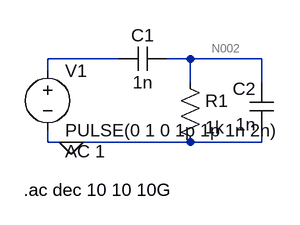
[diagram p0: schematic Draft9.asc]
Draft9.asc, the LTspice schematic file:
Version 4
SHEET 1 880 680
WIRE 128 112 32 112
WIRE 224 112 192 112
WIRE 320 112 224 112
WIRE 32 128 32 112
WIRE 224 144 224 112
WIRE 320 144 320 112
WIRE 32 224 32 208
WIRE 64 224 32 224
WIRE 224 224 64 224
WIRE 320 224 320 208
WIRE 320 224 224 224
FLAG 64 224 0
SYMBOL voltage 32 112 R0
WINDOW 123 24 124 Left 2
WINDOW 39 0 0 Left 0
SYMATTR InstName V1
SYMATTR Value PULSE(0 1 0 1p 1p 1n 2n)
SYMATTR Value2 AC 1
SYMBOL cap 192 96 R90
WINDOW 0 0 32 VBottom 2
WINDOW 3 32 32 VTop 2
SYMATTR InstName C1
SYMATTR Value 1n
SYMBOL cap 336 208 R180
WINDOW 0 24 56 Left 2
WINDOW 3 24 8 Left 2
SYMATTR InstName C2
SYMATTR Value 1n
SYMBOL res 208 128 R0
SYMATTR InstName R1
SYMATTR Value 1k
TEXT 0 288 Left 2 !.ac dec 10 10 10G

The netlist it stands for:
* Draft9.asc
V1 N001 0 PULSE(0 1 0 1p 1p 1n 2n) AC 1
C1 N002 N001 1n
C2 0 N002 1n
R1 N002 0 1k
.ac dec 10 10 10G
.backanno
.end

* Results of the author's LTspice run, read from the files saved beside the schematic
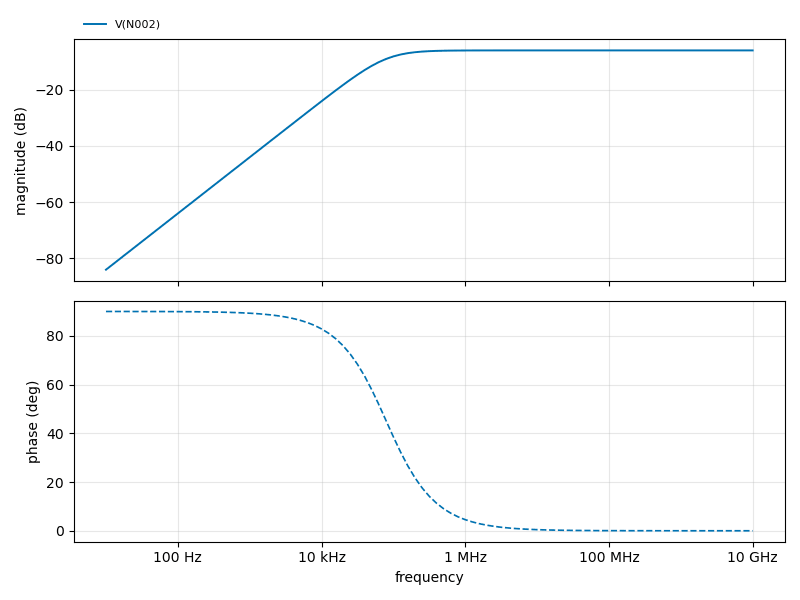
[diagram p1: AC Analysis of Draft9.asc, plotted from the saved traces]
* AC Analysis, 1 run:
*   V(N002): -84.04 dB at 10 Hz, -6.02 dB at 10 GHz, peak -6.02 dB at 10 GHz, 3 dB below the peak at 79.6 kHz